# Altium schematic sheet Antenna Connectors.SchDoc
size B; Organization: MASA; SheetNumber: 5; SheetTotal: 7
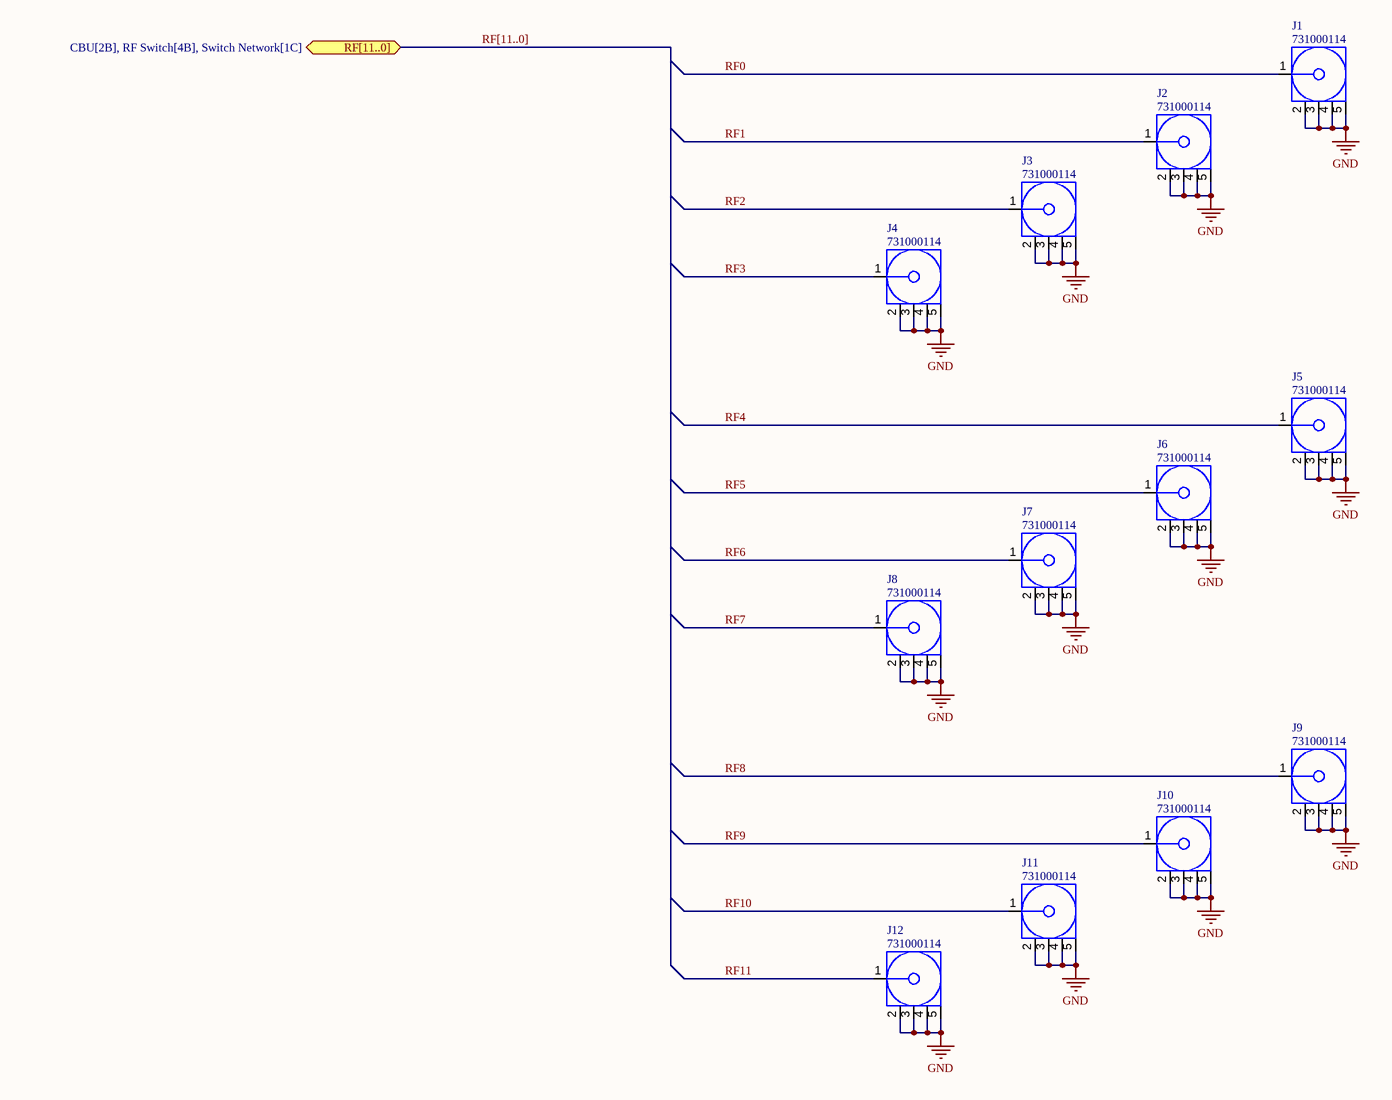
[diagram p0: Antenna Connectors.SchDoc]

## Parts
J1  731000114  [731000114_V]
J2  731000114  [731000114_V]
J3  731000114  [731000114_V]
J4  731000114  [731000114_V]
J5  731000114  [731000114_V]
J6  731000114  [731000114_V]
J7  731000114  [731000114_V]
J8  731000114  [731000114_V]
J9  731000114  [731000114_V]
J10  731000114  [731000114_V]
J11  731000114  [731000114_V]
J12  731000114  [731000114_V]

## Ports
RF[11..0] (bidir, see CBU[2B], RF Switch[4B], Switch Network[1C])

## Nets
GND: J1.2 J1.3 J1.4 J1.5 J2.2 J2.3 J2.4 J2.5 J3.2 J3.3 J3.4 J3.5 J4.2 J4.3 J4.4 J4.5 J5.2 J5.3 J5.4 J5.5 J6.2 J6.3 J6.4 J6.5 J7.2 J7.3 J7.4 J7.5 J8.2 J8.3 J8.4 J8.5 J9.2 J9.3 J9.4 J9.5 J10.2 J10.3 J10.4 J10.5 J11.2 J11.3 J11.4 J11.5 J12.2 J12.3 J12.4 J12.5
RF0: J1.1
RF1: J2.1
RF2: J3.1
RF3: J4.1
RF4: J5.1
RF5: J6.1
RF6: J7.1
RF7: J8.1
RF8: J9.1
RF9: J10.1
RF10: J11.1
RF11: J12.1

## Buses and harness runs
bus RF[11..0] = port RF[11..0]

## Notes on the sheet
- DWG. NO.
- REV.
- SHT.
- THIS DOCUMENT AND THE DATA DISCLOSED HEREIN OR HEREWITH IS THE PROPERTY OF ALTIUM LIMITED AND MAY BE FREELY DISTRIBUTED IN WHOLE. NO RIGHTS ARE RESERVED OR EXPRESS OR IMPLIED WARANTEE GIVEN.
- REVISION
- DESCRIPTION
- DATE
- APPROVED
- ENG:
- APPROVALS
- PROJECT
- DSN:
- CHK:
- REFERENCE DOCUMENTS
- PROJECT REVISION:
- TITLE
- DOCUMENT REVISION:
- DESIGN ITEM:
- BOM:
- FAB DWG:
- PCB DWG:
- ASSY DWG:
- SCALE:
- SIZE
- B
- CAGE CODE
- FILE NAME
- DWG NO.
- SHEET
- OF
- REV

## Library data of the parts
J1-J12 = 731000114: SMA Right-Angle PCB Jack Receptacle, Brass Body, Gold Plated, 50 Ohm, 5-Pin THD, RoHS, Tray; Manufacturer: Molex; Datasheet Version: 09/2016; Package Description: 5-Pin Through Hole Device, Body 14.8 x 6.35 mm, Pitch 2.54 mm; Datasheet URL: http://www.molex.com/webdocs/datasheets/pdf/en-us/0731000114_RF_COAX_CONNECTORS.pdf; Manufacturer URL: http://www.molex.com/; Package Reference: 731000114; Mounting Technology: ThroughHole; Package URL: http://www.molex.com/pdm_docs/sd/731000114_sd.pdf